# Altium schematic sheet EEPROM.SchDoc
size 127 x 101 mm; SheetNumber: 9; SheetTotal: 9
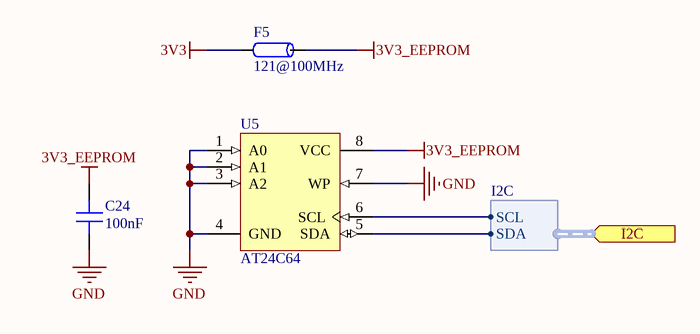
[diagram p0: EEPROM.SchDoc]

## Parts
C24  100nF  [CAP 0603_1608]
F5  121@100MHz  [Ferrite-0805]
U5  AT24C64  [TSSOP-8 3X4.4MM P0.65MM]

## Ports
I2C (in, harness I2C)

## Harnesses
I2C: SCL, SDA

## Nets
3V3: F5.1
3V3_EEPROM: C24.2 F5.2 U5.8(VCC)
GND: C24.1 U5.1(A0) U5.2(A1) U5.3(A2) U5.4(GND) U5.7(WP)
NetU5_5: U5.5(SDA) ; port I2C.SDA
NetU5_6: U5.6(SCL) ; port I2C.SCL

## Library data of the parts
C24 = Cap 0603: SMT Capacitor; VALUE: 100nF
F5 = Ferrite Bead
U5 = AT24C64 (SMD TSSOP): EEPROM Memory IC 64Kb (8K x 8) I²C 400kHz 900ns 8-TSSOP; PartNumber: AT24C64B-10TU-1.8